# Altium schematic sheet eeprom.SchDoc
size A4
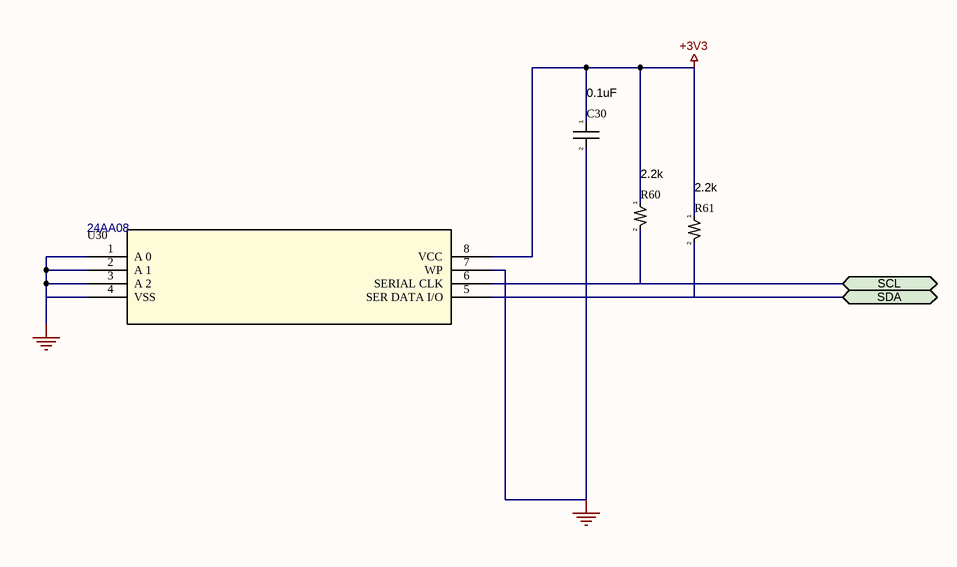
[diagram p0: eeprom.SchDoc]

## Parts
C30  0.1uF
R60  2.2k
R61  2.2k
U30  24AA08

## Ports
SCL (bidir), SDA (bidir)

## Nets
+3V3: C30.1 R60.1 R61.1 U30.8(VCC)
GND: C30.2 U30.1(A_0) U30.2(A_1) U30.3(A_2) U30.4(VSS) U30.7(WP)
SCL: R60.2 U30.6(SERIAL_CLK) ; port SCL
SDA: R61.2 U30.5(SER_DATA_I/O) ; port SDA

## Library data of the parts
C30 = GRM155R71C104KA88D: CAP CER 0.1UF 16V X7R 0402; Manufacturer_Name: Murata; Manufacturer_Part_Number: GRM155R71C104KA88D
R60 R61 = CR0402-FX-2201GLF: Manufacturer_Name: Bourns Electronics; Manufacturer_Part_Number: CR0402-FX-2201GLF
U30 = 24AA08-ISN: No Description Available; Manufacturer_Name: Microchip; Manufacturer_Part_Number: 24AA08-I/SN; Copyright: Copyright (C) 2026 Ultra Librarian. All rights reserved.; RefDes: RefDes; Type: Type